# Altium schematic sheet MB1364_Top.SchDoc: mb1319 Top: hierarchical view
size A4; Date: Not used; ApprovedBy: Not used; CheckedBy: Not used; Author: Not used; CompanyName: STMicroelectronics; DrawnBy: Not used; Engineer: Not used; Organization: Not used; Address1: Not used; Address2: Not used; Address3: Not used; Address4: Not used; DocumentNumber: 2; Revision: Not used; SheetNumber: 2; SheetTotal: 9; CurrentTime: Not used; CurrentDate: Not used; Time: Not used; DocumentFullPathAndName: Not used; DocumentName: Not used; ModifiedDate: Not used; ImagePath: Not used; ProjectName: Not used; Application_BuildNumber: Not used
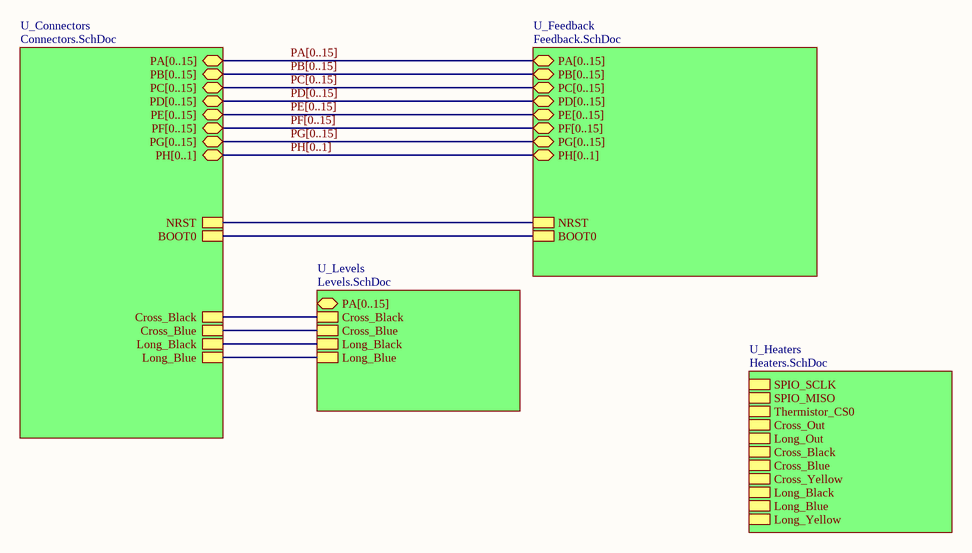
[diagram p0: MB1364_Top.SchDoc]

## Sub-sheets
U_Connectors = Connectors.SchDoc: PA[0..15] (bidir), PB[0..15] (bidir), PC[0..15] (bidir), PD[0..15] (bidir), PE[0..15] (bidir), PH[0..1] (bidir), NRST, BOOT0, PF[0..15] (bidir), PG[0..15] (bidir), Cross_Black, Cross_Blue, Long_Black, Long_Blue
U_Feedback = Feedback.SchDoc: NRST, BOOT0, PA[0..15] (bidir), PB[0..15] (bidir), PC[0..15] (bidir), PD[0..15] (bidir), PE[0..15] (bidir), PF[0..15] (bidir), PG[0..15] (bidir), PH[0..1] (bidir)
U_Heaters = Heaters.SchDoc: SPIO_SCLK, SPIO_MISO, Thermistor_CS0, Cross_Out, Long_Out, Cross_Black, Cross_Blue, Cross_Yellow, Long_Black, Long_Blue, Long_Yellow
U_Levels = Levels.SchDoc: PA[0..15] (bidir), Cross_Black, Cross_Blue, Long_Black, Long_Blue

## Nets
(unnamed): sheet U_Connectors/NRST, sheet U_Feedback/NRST
(unnamed): sheet U_Connectors/BOOT0, sheet U_Feedback/BOOT0
(unnamed): sheet U_Connectors/Cross_Black, sheet U_Levels/Cross_Black
(unnamed): sheet U_Connectors/Cross_Blue, sheet U_Levels/Cross_Blue
(unnamed): sheet U_Connectors/Long_Black, sheet U_Levels/Long_Black
(unnamed): sheet U_Connectors/Long_Blue, sheet U_Levels/Long_Blue

## Buses and harness runs
bus PA[0..15] = sheet U_Connectors/PA[0..15] = sheet U_Feedback/PA[0..15]
bus PB[0..15] = sheet U_Connectors/PB[0..15] = sheet U_Feedback/PB[0..15]
bus PC[0..15] = sheet U_Connectors/PC[0..15] = sheet U_Feedback/PC[0..15]
bus PD[0..15] = sheet U_Connectors/PD[0..15] = sheet U_Feedback/PD[0..15]
bus PE[0..15] = sheet U_Connectors/PE[0..15] = sheet U_Feedback/PE[0..15]
bus PF[0..15] = sheet U_Connectors/PF[0..15] = sheet U_Feedback/PF[0..15]
bus PG[0..15] = sheet U_Connectors/PG[0..15] = sheet U_Feedback/PG[0..15]
bus PH[0..1] = sheet U_Connectors/PH[0..1] = sheet U_Feedback/PH[0..1]

## Notes on the sheet
- Title:
- Project:
- Size:
- Revision:
- Variant:
- A4
- -
- Date:
- Reference:
- Sheet:
- of